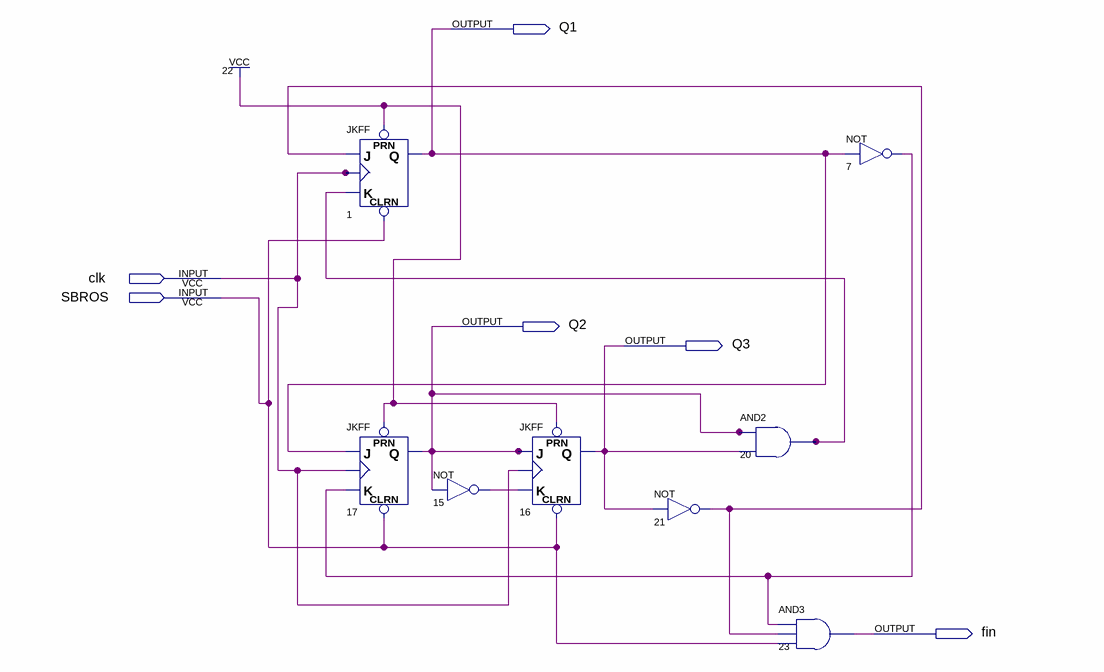
[diagram p0: schematic sheet]
// Quartus schematic count6djon2.bdf as structural Verilog: 8 symbols, 6 pins
module count6djon2 (
  input  clk,
  input  SBROS,
  output Q1,
  output Q2,
  output Q3,
  output fin
);

  wire n7_out, n15_out, n20_out, n21_out;

  JKFF u_1 (.PRN(1'b1), .CLRN(SBROS), .K(n20_out), .J(n21_out), .CLK(clk), .Q(Q1));
  JKFF u_17 (.PRN(1'b1), .CLRN(SBROS), .K(n7_out), .J(Q1), .CLK(clk), .Q(Q2));
  not u_15 (n15_out, Q2);
  JKFF u_16 (.PRN(1'b1), .CLRN(SBROS), .K(n15_out), .J(Q2), .CLK(clk), .Q(Q3));
  not u_21 (n21_out, Q3);
  and u_20 (n20_out, Q2, Q3);
  and u_23 (fin, n7_out, n21_out, SBROS);
  not u_7 (n7_out, Q1);
endmodule
